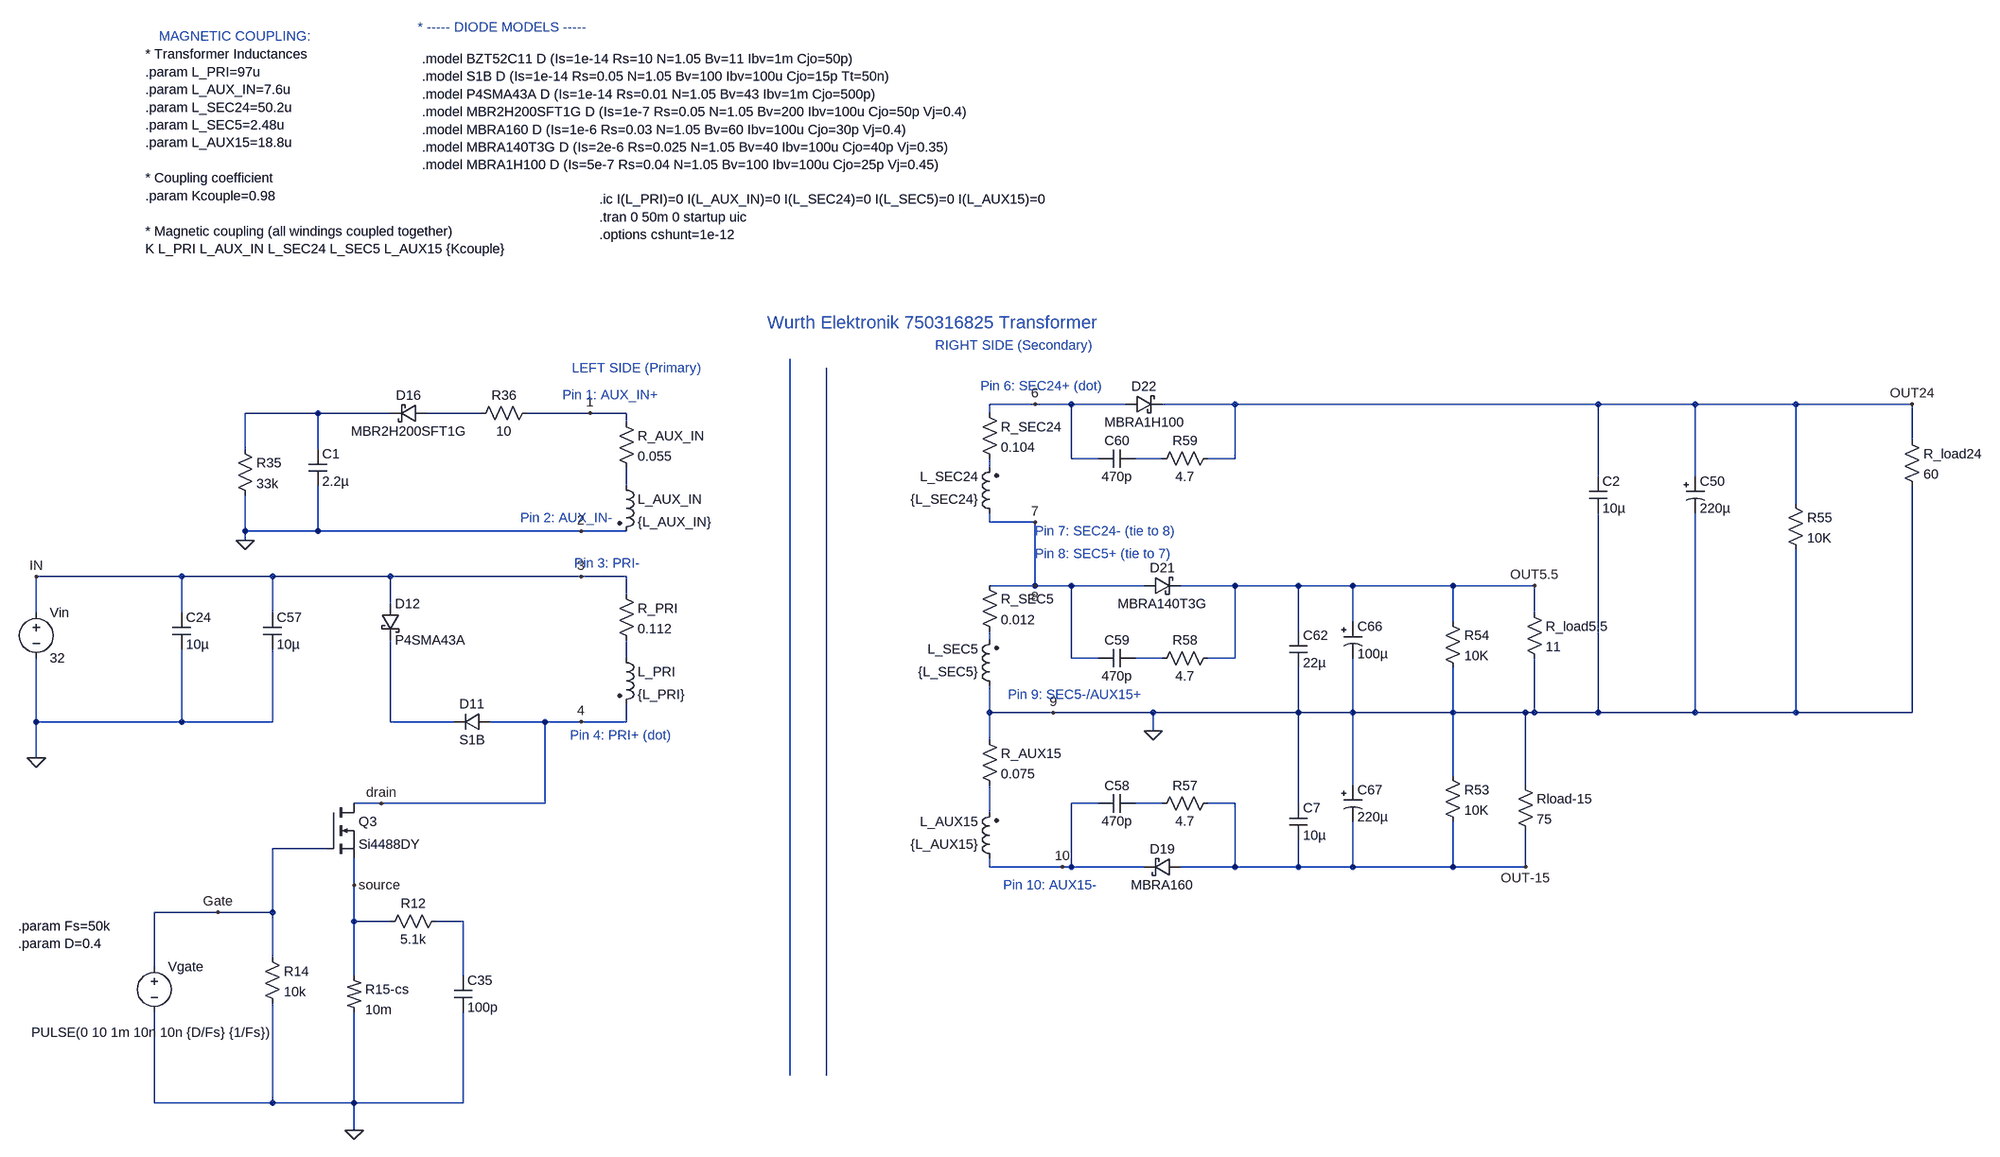
[diagram p0: schematic 750316825_transformer_pwm.asc]
750316825_transformer_pwm.asc, the LTspice schematic file:
Version 4
SHEET 1 2980 2244
WIRE 880 144 800 144
WIRE 944 144 880 144
WIRE 1040 144 944 144
WIRE 1232 144 1104 144
WIRE 1872 144 1232 144
WIRE 2080 144 1872 144
WIRE 2272 144 2080 144
WIRE 2512 144 2272 144
WIRE -384 160 -512 160
WIRE -256 160 -384 160
WIRE -96 160 -192 160
WIRE 96 160 -16 160
WIRE 160 160 96 160
WIRE 800 160 800 144
WIRE 160 176 160 160
WIRE 2512 208 2512 144
WIRE -512 224 -512 160
WIRE -384 224 -384 160
WIRE 944 240 944 144
WIRE 992 240 944 240
WIRE 1104 240 1056 240
WIRE 1232 240 1232 144
WIRE 1232 240 1184 240
WIRE 800 256 800 240
WIRE 1872 272 1872 144
WIRE 2080 272 2080 144
WIRE 160 288 160 256
WIRE 2272 320 2272 144
WIRE 800 352 800 336
WIRE 880 352 800 352
WIRE -512 368 -512 304
WIRE -384 368 -384 288
WIRE -384 368 -512 368
WIRE 80 368 -384 368
WIRE 160 368 80 368
WIRE -512 384 -512 368
WIRE -624 448 -880 448
WIRE -464 448 -624 448
WIRE -256 448 -464 448
WIRE 80 448 -256 448
WIRE 160 448 80 448
WIRE 880 464 880 352
WIRE 880 464 800 464
WIRE 944 464 880 464
WIRE 1072 464 944 464
WIRE 1232 464 1136 464
WIRE 1344 464 1232 464
WIRE 1440 464 1344 464
WIRE 1616 464 1440 464
WIRE 1760 464 1616 464
WIRE 160 480 160 448
WIRE -256 496 -256 448
WIRE -880 512 -880 448
WIRE -624 512 -624 448
WIRE -464 512 -464 448
WIRE 1760 512 1760 464
WIRE 1440 528 1440 464
WIRE 1616 528 1616 464
WIRE 1344 544 1344 464
WIRE 800 560 800 544
WIRE 160 592 160 560
WIRE 944 592 944 464
WIRE 992 592 944 592
WIRE 1104 592 1056 592
WIRE 1232 592 1232 464
WIRE 1232 592 1184 592
WIRE 800 688 800 640
WIRE 912 688 800 688
WIRE 1088 688 912 688
WIRE 1344 688 1344 608
WIRE 1344 688 1088 688
WIRE 1440 688 1440 592
WIRE 1440 688 1344 688
WIRE 1616 688 1616 608
WIRE 1616 688 1440 688
WIRE 1744 688 1616 688
WIRE 1760 688 1760 592
WIRE 1760 688 1744 688
WIRE 1872 688 1872 336
WIRE 1872 688 1760 688
WIRE 2080 688 2080 336
WIRE 2080 688 1872 688
WIRE 2272 688 2272 400
WIRE 2272 688 2080 688
WIRE 2512 688 2512 288
WIRE 2512 688 2272 688
WIRE -880 704 -880 592
WIRE -624 704 -624 576
WIRE -624 704 -880 704
WIRE -464 704 -464 576
WIRE -464 704 -624 704
WIRE -256 704 -256 560
WIRE -144 704 -256 704
WIRE 16 704 -80 704
WIRE 80 704 16 704
WIRE 160 704 160 672
WIRE 160 704 80 704
WIRE 1088 720 1088 688
WIRE 800 736 800 688
WIRE -880 768 -880 704
WIRE 1616 800 1616 688
WIRE 1440 816 1440 688
WIRE 1744 816 1744 688
WIRE -272 848 -320 848
WIRE 16 848 16 704
WIRE 16 848 -272 848
WIRE 992 848 944 848
WIRE 1104 848 1056 848
WIRE 1232 848 1184 848
WIRE 1344 848 1344 688
WIRE 800 864 800 816
WIRE -368 928 -464 928
WIRE 800 960 800 944
WIRE 928 960 800 960
WIRE 944 960 944 848
WIRE 944 960 928 960
WIRE 1072 960 944 960
WIRE 1232 960 1232 848
WIRE 1232 960 1136 960
WIRE 1344 960 1344 912
WIRE 1344 960 1232 960
WIRE 1440 960 1440 880
WIRE 1440 960 1344 960
WIRE 1616 960 1616 880
WIRE 1616 960 1440 960
WIRE 1744 960 1744 896
WIRE 1744 960 1616 960
WIRE -320 992 -320 944
WIRE -560 1040 -672 1040
WIRE -464 1040 -464 928
WIRE -464 1040 -560 1040
WIRE -320 1056 -320 992
WIRE -256 1056 -320 1056
WIRE -128 1056 -176 1056
WIRE -464 1120 -464 1040
WIRE -672 1136 -672 1040
WIRE -320 1152 -320 1056
WIRE -128 1152 -128 1056
WIRE 448 1328 448 64
WIRE 512 1328 512 80
WIRE -672 1376 -672 1216
WIRE -464 1376 -464 1200
WIRE -464 1376 -672 1376
WIRE -320 1376 -320 1216
WIRE -320 1376 -464 1376
WIRE -128 1376 -128 1216
WIRE -128 1376 -320 1376
WIRE -320 1424 -320 1376
FLAG 96 160 1
FLAG 80 368 2
FLAG 80 704 4
FLAG 80 448 3
FLAG 880 144 6
FLAG 880 352 7
FLAG 880 464 8
FLAG 912 688 9
FLAG 928 960 10
FLAG -320 1424 0
FLAG -560 1040 Gate
FLAG -880 448 IN
FLAG -880 768 0
FLAG 2512 144 OUT24
FLAG 1760 464 OUT5.5
FLAG 1744 960 OUT-15
FLAG 1088 720 0
FLAG -512 384 0
FLAG -272 848 drain
FLAG -320 992 source
SYMBOL res 144 160 R0
SYMATTR InstName R_AUX_IN
SYMATTR Value 0.055
SYMBOL res 144 464 R0
SYMATTR InstName R_PRI
SYMATTR Value 0.112
SYMBOL res 784 144 R0
SYMATTR InstName R_SEC24
SYMATTR Value 0.104
SYMBOL res 784 720 R0
SYMATTR InstName R_AUX15
SYMATTR Value 0.075
SYMBOL schottky -272 496 R0
SYMATTR InstName D12
SYMATTR Value P4SMA43A
SYMBOL diode -80 688 R90
WINDOW 0 0 32 VBottom 2
WINDOW 3 32 32 VTop 2
SYMATTR InstName D11
SYMATTR Value S1B
SYMBOL cap -480 512 R0
SYMATTR InstName C57
SYMATTR Value 10µ
SYMATTR SpiceLine V=50 Irms=0 Rser=0.003 Lser=1000p mfg="AVX" pn="12105C106KAT2A" type="Ceramic X7R"
SYMBOL cap -640 512 R0
SYMATTR InstName C24
SYMATTR Value 10µ
SYMATTR SpiceLine V=50 Irms=0 Rser=0.003 Lser=1000p mfg="AVX" pn="12105C106KAT2A" type="Ceramic X7R"
SYMBOL voltage -880 496 R0
WINDOW 123 0 0 Left 0
WINDOW 39 0 0 Left 0
SYMATTR InstName Vin
SYMATTR Value 32
SYMBOL res 0 144 R90
WINDOW 0 0 56 VBottom 2
WINDOW 3 32 56 VTop 2
SYMATTR InstName R36
SYMATTR Value 10
SYMATTR SpiceLine tol=1 pwr=0.125 mfg="AVX" pn="08051C471KAZ2A"
SYMBOL schottky -192 144 R90
WINDOW 0 0 32 VBottom 2
WINDOW 3 32 32 VTop 2
SYMATTR InstName D16
SYMATTR Value MBR2H200SFT1G
SYMBOL cap -400 224 R0
SYMATTR InstName C1
SYMATTR Value 2.2µ
SYMATTR SpiceLine V=50 Irms=0 Rser=0.01 Lser=500p mfg="Murata" pn="GRT188R61H225KE13D" type="Ceramic X5R"
SYMBOL res -528 208 R0
SYMATTR InstName R35
SYMATTR Value 33k
SYMATTR SpiceLine tol=0.125 pwr=1
SYMBOL nmos -368 848 R0
SYMATTR InstName Q3
SYMATTR Value Si4488DY
SYMBOL res2 -336 1152 R0
SYMATTR InstName R15-cs
SYMATTR Value 10m
SYMATTR SpiceLine tol=1 pwr=0.25 mfg="Vishay Dale" pn="ERJ-8BWFR010V"
SYMBOL res -480 1104 R0
SYMATTR InstName R14
SYMATTR Value 10k
SYMATTR SpiceLine tol=0.125 pwr=1
SYMBOL schottky 1040 160 R270
WINDOW 0 32 32 VTop 2
WINDOW 3 0 32 VBottom 2
SYMATTR InstName D22
SYMATTR Value MBRA1H100
SYMBOL schottky 1072 480 R270
WINDOW 0 32 32 VTop 2
WINDOW 3 0 32 VBottom 2
SYMATTR InstName D21
SYMATTR Value MBRA140T3G
SYMBOL schottky 1136 944 R90
WINDOW 0 0 32 VBottom 2
WINDOW 3 32 32 VTop 2
SYMATTR InstName D19
SYMATTR Value MBRA160
SYMBOL res 1200 224 R90
WINDOW 0 0 56 VBottom 2
WINDOW 3 32 56 VTop 2
SYMATTR InstName R59
SYMATTR Value 4.7
SYMATTR SpiceLine tol=0.2 pwr=0.1
SYMBOL cap 1056 224 R90
WINDOW 0 0 32 VBottom 2
WINDOW 3 32 32 VTop 2
SYMATTR InstName C60
SYMATTR Value 470p
SYMATTR SpiceLine V=100 Irms=0 Rser=0.08 Lser=500p mfg="Murata" pn="GRM188R72A471KA01D" type="Ceramic X7R"
SYMBOL res 1200 576 R90
WINDOW 0 0 56 VBottom 2
WINDOW 3 32 56 VTop 2
SYMATTR InstName R58
SYMATTR Value 4.7
SYMATTR SpiceLine tol=0.2 pwr=0.1
SYMBOL cap 1056 576 R90
WINDOW 0 0 32 VBottom 2
WINDOW 3 32 32 VTop 2
SYMATTR InstName C59
SYMATTR Value 470p
SYMATTR SpiceLine V=100 Irms=0 Rser=0.08 Lser=500p mfg="Murata" pn="GRM188R72A471KA01D" type="Ceramic X7R"
SYMBOL res 1200 832 R90
WINDOW 0 0 56 VBottom 2
WINDOW 3 32 56 VTop 2
SYMATTR InstName R57
SYMATTR Value 4.7
SYMATTR SpiceLine tol=0.2 pwr=0.1
SYMBOL cap 1056 832 R90
WINDOW 0 0 32 VBottom 2
WINDOW 3 32 32 VTop 2
SYMATTR InstName C58
SYMATTR Value 470p
SYMATTR SpiceLine V=100 Irms=0 Rser=0.08 Lser=500p mfg="Murata" pn="GRM188R72A471KA01D" type="Ceramic X7R"
SYMBOL cap 1328 544 R0
SYMATTR InstName C62
SYMATTR Value 22µ
SYMATTR SpiceLine V=10 Irms=0 Rser=0.003 Lser=800p mfg="Murata" pn="GRM31CR71A226ME15L" type="Ceramic X7R"
SYMBOL cap 1328 848 R0
SYMATTR InstName C7
SYMATTR Value 10µ
SYMATTR SpiceLine V=35 Irms=0 Rser=0.005 Lser=800p mfg="Taiyo Yuden" pn="GMK316AB7106KL-TR" type="Ceramic X7R"
SYMBOL polcap 1424 528 R0
SYMATTR InstName C66
SYMATTR Value 100µ
SYMATTR SpiceLine V=10 Irms=0 Rser=0.15 Lser=5n mfg="Panasonic" pn="EEUFM1A101" type="Electrolytic"
SYMBOL polcap 1424 816 R0
SYMATTR InstName C67
SYMATTR Value 220µ
SYMATTR SpiceLine V=35 Irms=0 Rser=0.1 Lser=5n mfg="Panasonic" pn="EEUFM1V221" type="Electrolytic"
SYMBOL res 1600 512 R0
SYMATTR InstName R54
SYMATTR Value 10K
SYMATTR SpiceLine tol=5 pwr=0.25 mfg="Panasonic" pn="ERJ-8GEYJ103V"
SYMBOL res 1600 784 R0
SYMATTR InstName R53
SYMATTR Value 10K
SYMATTR SpiceLine tol=5 pwr=0.25 mfg="Panasonic" pn="ERJ-8GEYJ103V"
SYMBOL res 2256 304 R0
SYMATTR InstName R55
SYMATTR Value 10K
SYMATTR SpiceLine tol=5 pwr=0.25 mfg="Panasonic" pn="ERJ-8GEYJ103V"
SYMBOL polcap 2064 272 R0
SYMATTR InstName C50
SYMATTR Value 220µ
SYMATTR SpiceLine V=35 Irms=0 Rser=0.1 Lser=5n mfg="Panasonic" pn="EEUFM1V221" type="Electrolytic"
SYMBOL cap 1856 272 R0
SYMATTR InstName C2
SYMATTR Value 10µ
SYMATTR SpiceLine V=35 Irms=0 Rser=0.005 Lser=800p mfg="Taiyo Yuden" pn="GMK316AB7106KL-TR" type="Ceramic X7R"
SYMBOL res 2496 192 R0
SYMATTR InstName R_load24
SYMATTR Value 60
SYMBOL res 1744 496 R0
SYMATTR InstName R_load5.5
SYMATTR Value 11
SYMBOL res 1728 800 R0
SYMATTR InstName Rload-15
SYMATTR Value 75
SYMBOL voltage -672 1120 R0
WINDOW 3 -217 132 Left 2
WINDOW 123 0 0 Left 0
WINDOW 39 0 0 Left 0
SYMATTR Value PULSE(0 10 1m 10n 10n {D/Fs} {1/Fs})
SYMATTR InstName Vgate
SYMBOL res 784 448 R0
SYMATTR InstName R_SEC5
SYMATTR Value 0.012
SYMBOL ind2 144 576 R0
SYMATTR InstName L_PRI
SYMATTR Value {L_PRI}
SYMATTR Type ind
SYMBOL ind2 144 272 R0
SYMATTR InstName L_AUX_IN
SYMATTR Value {L_AUX_IN}
SYMATTR Type ind
SYMBOL ind2 816 352 R180
WINDOW 0 36 80 Left 2
WINDOW 3 36 40 Left 2
SYMATTR InstName L_SEC24
SYMATTR Value {L_SEC24}
SYMATTR Type ind
SYMBOL ind2 816 656 R180
WINDOW 0 36 80 Left 2
WINDOW 3 36 40 Left 2
SYMATTR InstName L_SEC5
SYMATTR Value {L_SEC5}
SYMATTR Type ind
SYMBOL ind2 816 960 R180
WINDOW 0 36 80 Left 2
WINDOW 3 36 40 Left 2
SYMATTR InstName L_AUX15
SYMATTR Value {L_AUX15}
SYMATTR Type ind
SYMBOL cap -144 1152 R0
SYMATTR InstName C35
SYMATTR Value 100p
SYMATTR SpiceLine V=50 Irms=0 Rser=0.1 Lser=400p mfg="AVX" pn="06035C102KAT2A" type="Ceramic X7R"
SYMBOL res -160 1040 R90
WINDOW 0 0 56 VBottom 2
WINDOW 3 32 56 VTop 2
SYMATTR InstName R12
SYMATTR Value 5.1k
SYMATTR SpiceLine tol=0.125 pwr=1
TEXT 408 0 Left 3 ;Wurth Elektronik 750316825 Transformer
TEXT 64 80 Left 2 ;LEFT SIDE (Primary)
TEXT 704 40 Left 2 ;RIGHT SIDE (Secondary)
TEXT 216 128 Right 2 ;Pin 1: AUX_IN+
TEXT 136 344 Right 2 ;Pin 2: AUX_IN-
TEXT 240 728 Right 2 ;Pin 4: PRI+ (dot)
TEXT 184 424 Right 2 ;Pin 3: PRI-
TEXT 784 112 Left 2 ;Pin 6: SEC24+ (dot)
TEXT 880 368 Left 2 ;Pin 7: SEC24- (tie to 8)
TEXT 880 408 Left 2 ;Pin 8: SEC5+ (tie to 7)
TEXT 832 656 Left 2 ;Pin 9: SEC5-/AUX15+
TEXT 824 992 Left 2 ;Pin 10: AUX15-
TEXT -664 -520 Left 2 ;MAGNETIC COUPLING:
TEXT -208 -536 Left 2 ;* ----- DIODE MODELS -----
TEXT -200 -480 Left 2 !.model BZT52C11 D (Is=1e-14 Rs=10 N=1.05 Bv=11 Ibv=1m Cjo=50p)\n.model S1B D (Is=1e-14 Rs=0.05 N=1.05 Bv=100 Ibv=100u Cjo=15p Tt=50n)\n.model P4SMA43A D (Is=1e-14 Rs=0.01 N=1.05 Bv=43 Ibv=1m Cjo=500p)\n.model MBR2H200SFT1G D (Is=1e-7 Rs=0.05 N=1.05 Bv=200 Ibv=100u Cjo=50p Vj=0.4)\n.model MBRA160 D (Is=1e-6 Rs=0.03 N=1.05 Bv=60 Ibv=100u Cjo=30p Vj=0.4)\n.model MBRA140T3G D (Is=2e-6 Rs=0.025 N=1.05 Bv=40 Ibv=100u Cjo=40p Vj=0.35)\n.model MBRA1H100 D (Is=5e-7 Rs=0.04 N=1.05 Bv=100 Ibv=100u Cjo=25p Vj=0.45)
TEXT 112 -232 Left 2 !.ic I(L_PRI)=0 I(L_AUX_IN)=0 I(L_SEC24)=0 I(L_SEC5)=0 I(L_AUX15)=0\n.tran 0 50m 0 startup uic\n.options cshunt=1e-12
TEXT -688 -488 Left 2 !* Transformer Inductances\n.param L_PRI=97u\n.param L_AUX_IN=7.6u\n.param L_SEC24=50.2u\n.param L_SEC5=2.48u\n.param L_AUX15=18.8u\n \n* Coupling coefficient\n.param Kcouple=0.98\n \n* Magnetic coupling (all windings coupled together)\nK L_PRI L_AUX_IN L_SEC24 L_SEC5 L_AUX15 {Kcouple}
TEXT -912 1064 Left 2 !.param Fs=50k\n.param D=0.4

The netlist it stands for:
* 750316825_transformer_pwm.asc
R_AUX_IN 1 N005 0.055
R_PRI IN N007 0.112
R_SEC24 6 N004 0.104
R_AUX15 0 N011 0.075
D12 IN N009 P4SMA43A
D11 drain N009 S1B
C57 IN 0 10µ V=50 Irms=0 Rser=0.003 Lser=1000p mfg="AVX" pn="12105C106KAT2A" type="Ceramic X7R"
C24 IN 0 10µ V=50 Irms=0 Rser=0.003 Lser=1000p mfg="AVX" pn="12105C106KAT2A" type="Ceramic X7R"
Vin IN 0 32
R36 1 N002 10 tol=1 pwr=0.125 mfg="AVX" pn="08051C471KAZ2A"
D16 N002 N001 MBR2H200SFT1G
C1 N001 0 2.2µ V=50 Irms=0 Rser=0.01 Lser=500p mfg="Murata" pn="GRT188R61H225KE13D" type="Ceramic X5R"
R35 N001 0 33k tol=0.125 pwr=1
M§Q3 drain Gate source source Si4488DY
R15-cs source 0 10m tol=1 pwr=0.25 mfg="Vishay Dale" pn="ERJ-8BWFR010V"
R14 Gate 0 10k tol=0.125 pwr=1
D22 6 OUT24 MBRA1H100
D21 8 OUT5.5 MBRA140T3G
D19 OUT-15 10 MBRA160
R59 OUT24 N003 4.7 tol=0.2 pwr=0.1
C60 N003 6 470p V=100 Irms=0 Rser=0.08 Lser=500p mfg="Murata" pn="GRM188R72A471KA01D" type="Ceramic X7R"
R58 OUT5.5 N008 4.7 tol=0.2 pwr=0.1
C59 N008 8 470p V=100 Irms=0 Rser=0.08 Lser=500p mfg="Murata" pn="GRM188R72A471KA01D" type="Ceramic X7R"
R57 OUT-15 N010 4.7 tol=0.2 pwr=0.1
C58 N010 10 470p V=100 Irms=0 Rser=0.08 Lser=500p mfg="Murata" pn="GRM188R72A471KA01D" type="Ceramic X7R"
C62 OUT5.5 0 22µ V=10 Irms=0 Rser=0.003 Lser=800p mfg="Murata" pn="GRM31CR71A226ME15L" type="Ceramic X7R"
C7 0 OUT-15 10µ V=35 Irms=0 Rser=0.005 Lser=800p mfg="Taiyo Yuden" pn="GMK316AB7106KL-TR" type="Ceramic X7R"
C66 OUT5.5 0 100µ V=10 Irms=0 Rser=0.15 Lser=5n mfg="Panasonic" pn="EEUFM1A101" type="Electrolytic"
C67 0 OUT-15 220µ V=35 Irms=0 Rser=0.1 Lser=5n mfg="Panasonic" pn="EEUFM1V221" type="Electrolytic"
R54 OUT5.5 0 10K tol=5 pwr=0.25 mfg="Panasonic" pn="ERJ-8GEYJ103V"
R53 0 OUT-15 10K tol=5 pwr=0.25 mfg="Panasonic" pn="ERJ-8GEYJ103V"
R55 OUT24 0 10K tol=5 pwr=0.25 mfg="Panasonic" pn="ERJ-8GEYJ103V"
C50 OUT24 0 220µ V=35 Irms=0 Rser=0.1 Lser=5n mfg="Panasonic" pn="EEUFM1V221" type="Electrolytic"
C2 OUT24 0 10µ V=35 Irms=0 Rser=0.005 Lser=800p mfg="Taiyo Yuden" pn="GMK316AB7106KL-TR" type="Ceramic X7R"
R_load24 OUT24 0 60
R_load5.5 OUT5.5 0 11
Rload-15 0 OUT-15 75
Vgate Gate 0 PULSE(0 10 1m 10n 10n {D/Fs} {1/Fs})
R_SEC5 8 N006 0.012
L_PRI N007 drain {L_PRI}
L_AUX_IN N005 0 {L_AUX_IN}
L_SEC24 8 N004 {L_SEC24}
L_SEC5 0 N006 {L_SEC5}
L_AUX15 10 N011 {L_AUX15}
C35 N012 0 100p V=50 Irms=0 Rser=0.1 Lser=400p mfg="AVX" pn="06035C102KAT2A" type="Ceramic X7R"
R12 N012 source 5.1k tol=0.125 pwr=1
.model D D
.lib standard.dio
.model NMOS NMOS
.model PMOS PMOS
.lib standard.mos
* Wurth Elektronik 750316825 Transformer
* LEFT SIDE (Primary)
* RIGHT SIDE (Secondary)
* Pin 1: AUX_IN+
* Pin 2: AUX_IN-
* Pin 4: PRI+ (dot)
* Pin 3: PRI-
* Pin 6: SEC24+ (dot)
* Pin 7: SEC24- (tie to 8)
* Pin 8: SEC5+ (tie to 7)
* Pin 9: SEC5-/AUX15+
* Pin 10: AUX15-
* MAGNETIC COUPLING:
* * ----- DIODE MODELS -----
.model BZT52C11 D (Is=1e-14 Rs=10 N=1.05 Bv=11 Ibv=1m Cjo=50p)
.model S1B D (Is=1e-14 Rs=0.05 N=1.05 Bv=100 Ibv=100u Cjo=15p Tt=50n)
.model P4SMA43A D (Is=1e-14 Rs=0.01 N=1.05 Bv=43 Ibv=1m Cjo=500p)
.model MBR2H200SFT1G D (Is=1e-7 Rs=0.05 N=1.05 Bv=200 Ibv=100u Cjo=50p Vj=0.4)
.model MBRA160 D (Is=1e-6 Rs=0.03 N=1.05 Bv=60 Ibv=100u Cjo=30p Vj=0.4)
.model MBRA140T3G D (Is=2e-6 Rs=0.025 N=1.05 Bv=40 Ibv=100u Cjo=40p Vj=0.35)
.model MBRA1H100 D (Is=5e-7 Rs=0.04 N=1.05 Bv=100 Ibv=100u Cjo=25p Vj=0.45)
.ic I(L_PRI)=0 I(L_AUX_IN)=0 I(L_SEC24)=0 I(L_SEC5)=0 I(L_AUX15)=0
.tran 0 50m 0 startup uic
.options cshunt=1e-12
* Transformer Inductances
.param L_PRI=97u
.param L_AUX_IN=7.6u
.param L_SEC24=50.2u
.param L_SEC5=2.48u
.param L_AUX15=18.8u
* Coupling coefficient
.param Kcouple=0.98
* Magnetic coupling (all windings coupled together)
K L_PRI L_AUX_IN L_SEC24 L_SEC5 L_AUX15 {Kcouple}
.param Fs=50k
.param D=0.4
.backanno
.end